# EAGLE schematic 2013 Touchscreen Controller 1 (EAGLE 6.4)
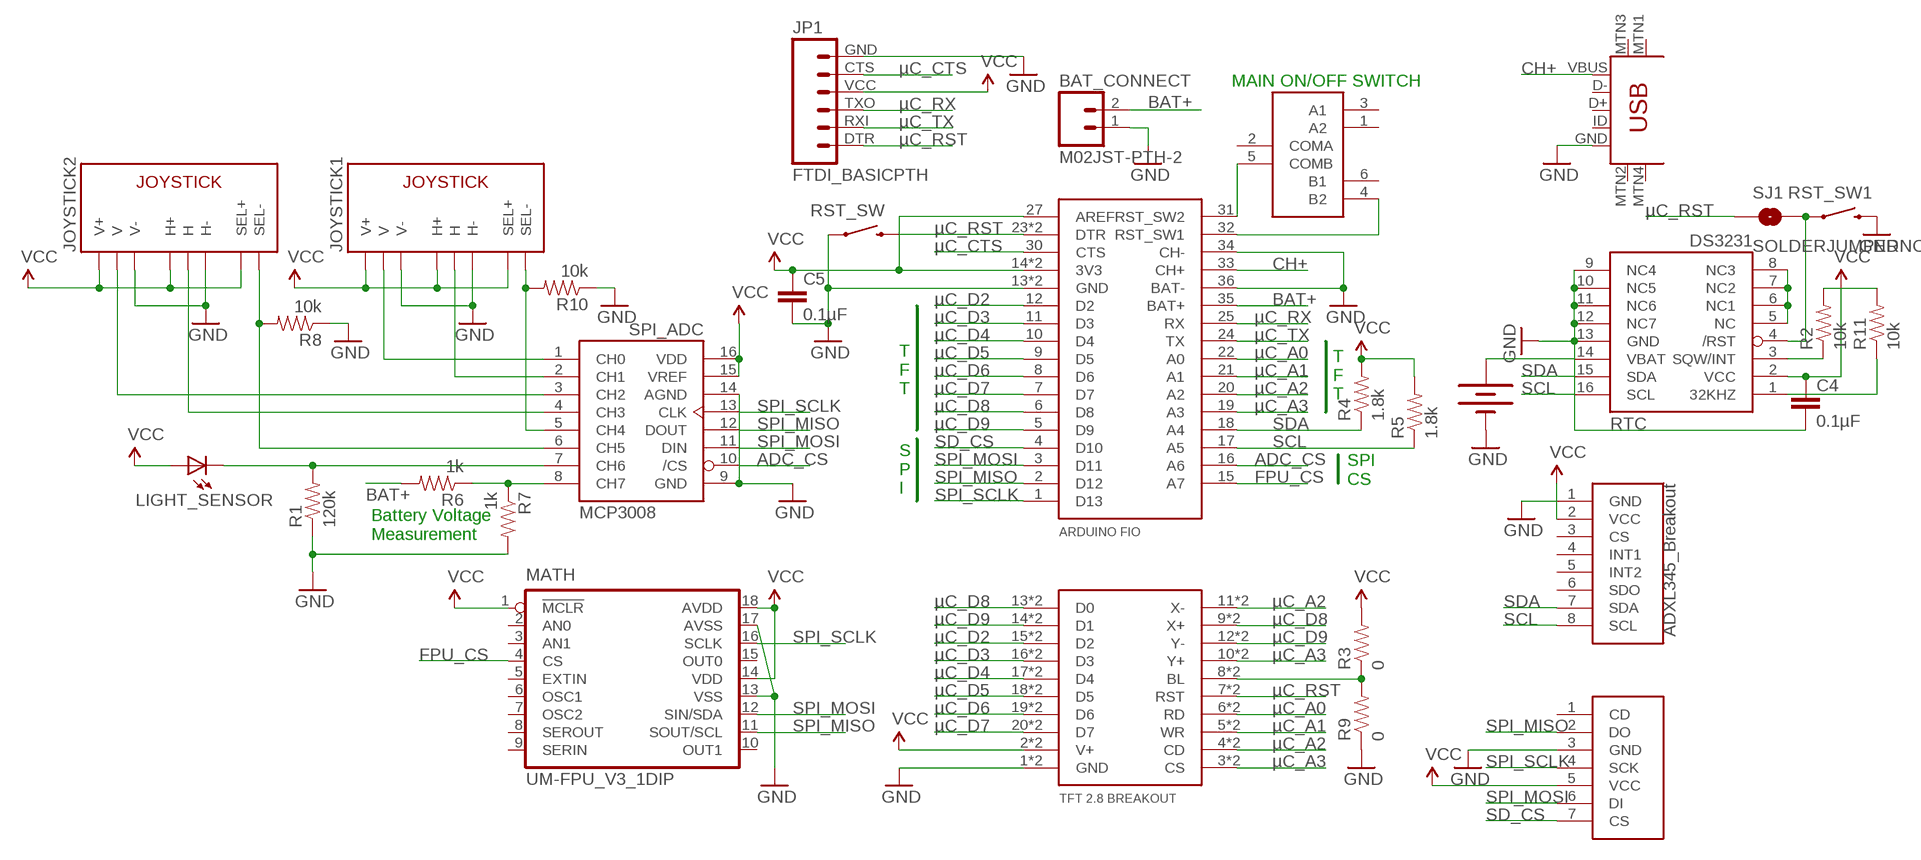
[diagram p0: schematic, sheet 1]

## Parts
ACCEL1  ADXL345_BREAKOUT  [1X08]
BAT1  BATTERY12MM  [BATTCON_12MM]
BAT_CONNECT  M02JST-PTH-2  [JST-2-PTH]
C4  0.1µF  CAPPTH  [CAP-PTH-SMALL]
C5  0.1µF  CAPPTH  [CAP-PTH-SMALL]
JOYSTICK1  JOYSTICKPTH  [JOYSTICK]
JOYSTICK2  JOYSTICKPTH  [JOYSTICK]
JP1  FTDI_BASICPTH  [FTDI_BASIC]
LIGHT_SENSOR  LED5MM  [LED5MM]
MATH  UM-FPU_V3_1DIP  [DIL18]
R1  120k  RESISTORPTH-1/4W  [AXIAL-0.4]
R2  10k  RESISTORPTH-1/4W  [AXIAL-0.4]
R3  0  RESISTORPTH-1/4W  [AXIAL-0.4]
R4  1.8k  RESISTORPTH-1/4W  [AXIAL-0.4]
R5  1.8k  RESISTORPTH-1/4W  [AXIAL-0.4]
R6  1k  RESISTORPTH-1/4W  [AXIAL-0.4]
R7  1k  RESISTORPTH-1/4W  [AXIAL-0.4]
R8  10k  RESISTORPTH-1/4W  [AXIAL-0.4]
R9  0  RESISTORPTH-1/4W  [AXIAL-0.4]
R10  10k  RESISTORPTH-1/4W  [AXIAL-0.4]
R11  10k  RESISTORPTH-1/4W  [AXIAL-0.4]
RST_SW  SWITCH-MOMENTARY-2PTH  [TACTILE-PTH]
RST_SW1  SWITCH-MOMENTARY-2PTH  [TACTILE-PTH]
RTC  DS3231/SO  [SO16W]
SJ1  SOLDERJUMPERNO  [SJ_2S-NO]
SPI_ADC  MCP3008  [DIL16]
U$1  ARDUINOFIO  [ARDUINOFIO]
U$2  TFT2.8BREAKOUT  [TFT2.8BREAKOUT]
U$3  RIGHTANGLE_DPDT_PTH  [RIGHTANGLE_DPDT_PTH]
U$4  MICROSD_BREAKOUT  [MICROSD_BREAKOUT]
USB_CHARGE  USB-MINIB-5PIN  [USB-MINIB]

## Nets
ADC_CS: SPI_ADC.10(/CS) U$1.16(A6)
BAT+: BAT_CONNECT.2 R6.P$2 U$1.35(BAT+)
CH+: U$1.33(CH+) USB_CHARGE.VBUS
FPU_CS: MATH.4(CS) U$1.15(A7)
GND [vcc]: ACCEL1.1(GND) BAT1.GND(-) BAT_CONNECT.1 C4.2 C5.2 JOYSTICK1.H3(H-) JOYSTICK1.V3(V-) JOYSTICK2.H3(H-) JOYSTICK2.V3(V-) JP1.GND MATH.13(VSS) MATH.17(AVSS) R1.P$1 R7.P$2 R8.P$1 R9.P$1 R10.P$1 RST_SW1.3 RST_SW.1 RTC.9(NC4) RTC.10(NC5) RTC.11(NC6) RTC.12(NC7) RTC.13(GND) SPI_ADC.9(GND) SPI_ADC.14(AGND) U$1.13(GND) U$1.28(GND) U$1.34(CH-) U$1.36(BAT-) U$2.1(GND) U$2.21(GND) U$4.3(GND) USB_CHARGE.GND
N$1: JOYSTICK1.B2A(SEL-) R10.P$2 SPI_ADC.5(CH4)
N$2: JOYSTICK2.B2A(SEL-) R8.P$2 SPI_ADC.6(CH5)
N$3: LIGHT_SENSOR.K(C) R1.P$2 SPI_ADC.7(CH6)
N$5: U$1.31(RST_SW2) U$3.5(COMB)
N$8: U$1.32(RST_SW1) U$3.4(B2)
N$9: RST_SW1.1 RTC.4(/RST) SJ1.2
N$11: R3.P$1 R9.P$2 U$2.8(BL) U$2.34(BL)
N$12: R6.P$1 R7.P$1 SPI_ADC.8(CH7)
N$13: BAT1.PWR@1(+) RTC.14(VBAT)
N$15: R2.P$1 RTC.3(SQW/INT)
N$16: R11.P$1 RTC.1(32KHZ)
N$18: R2.P$2 R11.P$2
N$23: JOYSTICK1.V2(V) SPI_ADC.1(CH0)
N$24: JOYSTICK1.H2(H) SPI_ADC.2(CH1)
N$25: JOYSTICK2.V2(V) SPI_ADC.3(CH2)
N$26: JOYSTICK2.H2(H) SPI_ADC.4(CH3)
N$37: RTC.5(NC) RTC.6(NC1) RTC.7(NC2) RTC.8(NC3)
SCL: ACCEL1.8(SCL) R5.P$1 RTC.16(SCL) U$1.17(A5)
SD_CS: U$1.4(D10) U$4.7(CS)
SDA: ACCEL1.7(SDA) R4.P$1 RTC.15(SDA) U$1.18(A4)
SPI_MISO: MATH.11(SOUT/SCL) SPI_ADC.12(DOUT) U$1.2(D12) U$4.2(DO)
SPI_MOSI: MATH.12(SIN/SDA) SPI_ADC.11(DIN) U$1.3(D11) U$4.6(DI)
SPI_SCLK: MATH.16(SCLK) SPI_ADC.13(CLK) U$1.1(D13) U$4.4(SCK)
VCC: ACCEL1.2(VCC) C4.1 C5.1 JOYSTICK1.B1A(SEL+) JOYSTICK1.H1(H+) JOYSTICK1.V1(V+) JOYSTICK2.B1A(SEL+) JOYSTICK2.H1(H+) JOYSTICK2.V1(V+) JP1.VCC LIGHT_SENSOR.A MATH.1(!MCLR) MATH.14(VDD) MATH.18(AVDD) R3.P$2 R4.P$2 R5.P$2 RTC.2(VCC) SPI_ADC.15(VREF) SPI_ADC.16(VDD) U$1.14(3V3) U$1.26(3V3) U$1.27(AREF) U$2.2(V+) U$2.31(V+) U$4.5(VCC)
µC_A0: U$1.22(A0) U$2.6(RD) U$2.33(RD)
µC_A1: U$1.21(A1) U$2.5(WR) U$2.23(WR)
µC_A2: U$1.20(A2) U$2.4(CD) U$2.11(X-) U$2.26(X-) U$2.32(CD)
µC_A3: U$1.19(A3) U$2.3(CS) U$2.10(Y+) U$2.22(CS) U$2.35(Y+)
µC_CTS: JP1.CTS U$1.30(CTS)
µC_D2: U$1.12(D2) U$2.15(D2) U$2.28(D2)
µC_D3: U$1.11(D3) U$2.16(D3) U$2.38(D3)
µC_D4: U$1.10(D4) U$2.17(D4) U$2.29(D4)
µC_D5: U$1.9(D5) U$2.18(D5) U$2.39(D5)
µC_D6: U$1.8(D6) U$2.19(D6) U$2.30(D6)
µC_D7: U$1.7(D7) U$2.20(D7) U$2.40(D7)
µC_D8: U$1.6(D8) U$2.9(X+) U$2.13(D0) U$2.25(X+) U$2.27(D0)
µC_D9: U$1.5(D9) U$2.12(Y-) U$2.14(D1) U$2.36(Y-) U$2.37(D1)
µC_RST: JP1.DTR RST_SW.3 SJ1.1 U$1.23(DTR) U$1.29(DTR) U$2.7(RST) U$2.24(RST)
µC_RX: JP1.TXO U$1.25(RX)
µC_TX: JP1.RXI U$1.24(TX)
Unconnected: ACCEL1.3(CS) ACCEL1.4(INT1) ACCEL1.5(INT2) ACCEL1.6(SDO) MATH.2(AN0) MATH.3(AN1) MATH.5(EXTIN) MATH.6(OSC1) MATH.7(OSC2) MATH.8(SEROUT) MATH.9(SERIN) MATH.10(OUT1) MATH.15(OUT0) U$3.1(A2) U$3.2(COMA) U$3.3(A1) U$3.6(B1) U$4.1(CD) USB_CHARGE.D+ USB_CHARGE.D- USB_CHARGE.ID USB_CHARGE.MTN1(MTN2) USB_CHARGE.MTN2(MTN3) USB_CHARGE.MTN3(MTN1) USB_CHARGE.MTN4

## Notes on the sheet
- MAIN ON/OFF SWITCH
- T
  F
  T
- T
  F
  T
- SPI
  CS
- S
  P
  I
- Battery Voltage
  Measurement

## Library data of the parts
ACCEL1 = Custom Library:ADXL345_BREAKOUT
BAT1 = SparkFun-Electromechanical:BATTERY: Battery Holders Various common sizes : AA, AAA, 20mm coin cell and 12mm coin cell. 20MM_4LEGS, BATT-10373
BAT_CONNECT = SparkFun-Connectors:M02: Standard 2-pin 0.1" header. Use with - straight break away headers ( PRT-00116) - right angle break away headers (PRT-00553) - swiss pins (PRT-00743) - machine pins (PRT-00117) - female headers (PRT-00115) Molex polarized connector foot print use with: PRT-08233 with associated crimp pins and housings. 2.54_SCREWTERM for use with PRT-10571. 3.5mm Screw Terminal footprints for PRT-08084 5mm Screw Terminal footprints for use with PRT-08433
C4 C5 = SparkFun-Capacitors:CAP: Capacitor Standard 0603 ceramic capacitor, and 0.1" leaded capacitor.
JOYSTICK1 JOYSTICK2 = SparkFun-Electromechanical:JOYSTICK: Thumb Joystick Joystick commonly found in PS2 controllers. Two pots and a select switch. Footprint proven. Spark Fun Electronics SKU : COM-09032
JP1 = SparkFun-Connectors:FTDI_BASIC: FTDI Basic header with labels
LIGHT_SENSOR = led:LED: LED OSRAM: - CHIPLED LG R971, LG N971, LY N971, LG Q971, LY Q971, LO R971, LY R971 LH N974, LH R974 LS Q976, LO Q976, LY Q976 LO Q996 - Hyper CHIPLED LW Q18S LB Q993, LB Q99A, LB R99A - SideLED LS A670, LO A670, LY A670, LG A670, LP A670 LB A673, LV A673, LT A673, LW A673 LH A674 LY A675 LS A676, LA A676, LO A676, LY A676, LW A676 LS A679, LY A679, LG A679 - Hyper Micro SIDELED® LS Y876, LA Y876, LO Y876, LY Y876 LT Y87S - SmartLED LW L88C, LW L88S LB L89C, LB L89S, LG L890 LS L89K, LO L89K, LY L89K LS L896, LA L896, LO L896, LY L896 - TOPLED LS T670, LO T670, LY T670, LG T670, LP T670 LSG T670, LSP T670, LSY T670, LOP T670, LYG T670 LG T671, LOG T671, LSG T671 LB T673, LV T673, LT T673, LW T673 LH T674 LS T676, LA T676, LO T676, LY T676, LB T676, LH T676, LSB T676, LW T676 LB T67C, LV T67C, LT T67C, LS T67K, LO T67K, LY T67K, LW E67C LS E67B, LA E67B, LO E67B, LY E67B, LB E67C, LV E67C, LT E67C LW T67C LS T679, LY T679, LG T679 LS T770, LO T770, LY T770, LG T770, LP T770 LB T773, LV T773, LT T773, LW T773 LH T774 LS E675, LA E675, LY E675, LS T675 LS T776, LA T776, LO T776, LY T776, LB T776 LHGB T686 LT T68C, LB T68C - Hyper Mini TOPLED® LB M676 - Mini TOPLED Santana® LG M470 LS M47K, LO M47K, LY M47K Source: http://www.osram.convergy.de LUXEON: - LUMILED® LXK2-PW12-R00, LXK2-PW12-S00, LXK2-PW14-U00, LXK2-PW14-V00 LXK2-PM12-R00, LXK2-PM12-S00, LXK2-PM14-U00 LXK2-PE12-Q00, LXK2-PE12-R00, LXK2-PE12-S00, LXK2-PE14-T00, LXK2-PE14-U00 LXK2-PB12-K00, LXK2-PB12-L00, LXK2-PB12-M00, LXK2-PB14-N00, LXK2-PB14-P00, LXK2-PB14-Q00 LXK2-PR12-L00, LXK2-PR12-M00, LXK2-PR14-Q00, LXK2-PR14-R00 LXK2-PD12-Q00, LXK2-PD12-R00, LXK2-PD12-S00 LXK2-PH12-R00, LXK2-PH12-S00 LXK2-PL12-P00, LXK2-PL12-Q00, LXK2-PL12-R00 Source: www.luxeon.com KINGBRIGHT: KA-3528ASYC Source: www.kingbright.com
MATH = Micromega:UM-FPU_V3_1: uM-FPU V3.1 Floating Point Coprocessor This device is a 32-bit floating point coprocessor that can be interfaced using I2C or SPI. The DIP-18 and SOIC-18 packages are stock items.
R1-R11 = SparkFun-Resistors:RESISTOR: Resistor Basic schematic elements and footprints for 0603, 1206, and PTH resistors.
RST_SW RST_SW1 = SparkFun-Electromechanical:SWITCH-MOMENTARY-2: Various NO switches- pushbuttons, reed, etc
RTC = adafruit:DS3231
SJ1 = SparkFun-Passives:SOLDERJUMPER: Solder Jumper Standard SMD solder jumper. Used to automate production. Two varients : Normally Open and Normally Closed are the same, but have different paste layers. NC will have a large amount of paste and should jumper during reflow.
SPI_ADC = adafruit:MCP3008
U$1 = Custom Library:ARDUINOFIO
U$2 = Custom Library:TFT2.8BREAKOUT
U$3 = Custom Library:RIGHTANGLE_DPDT_PTH
U$4 = Custom Library:MICROSD_BREAKOUT
USB_CHARGE = SparkFun-Connectors:USB-MINIB: Mini-USB "B" connector with 5th pin broken out. Created new symbol breaking out 5th "ID" pin in mini/micro USB connector spec. See: http://en.wikipedia.org/wiki/Mini_usb#Cables. Uses same footprint as 4-pin symbol. Also added pins to connect to mounting / shield pads if required (probably not generally needed as signals aren't shielded once they leave the connector).

## Net classes
1 vcc: width 0.254 mm